# Altium schematic sheet OVPSwitch.SchDoc
size A; SheetNumber: 1; SheetTotal: 1
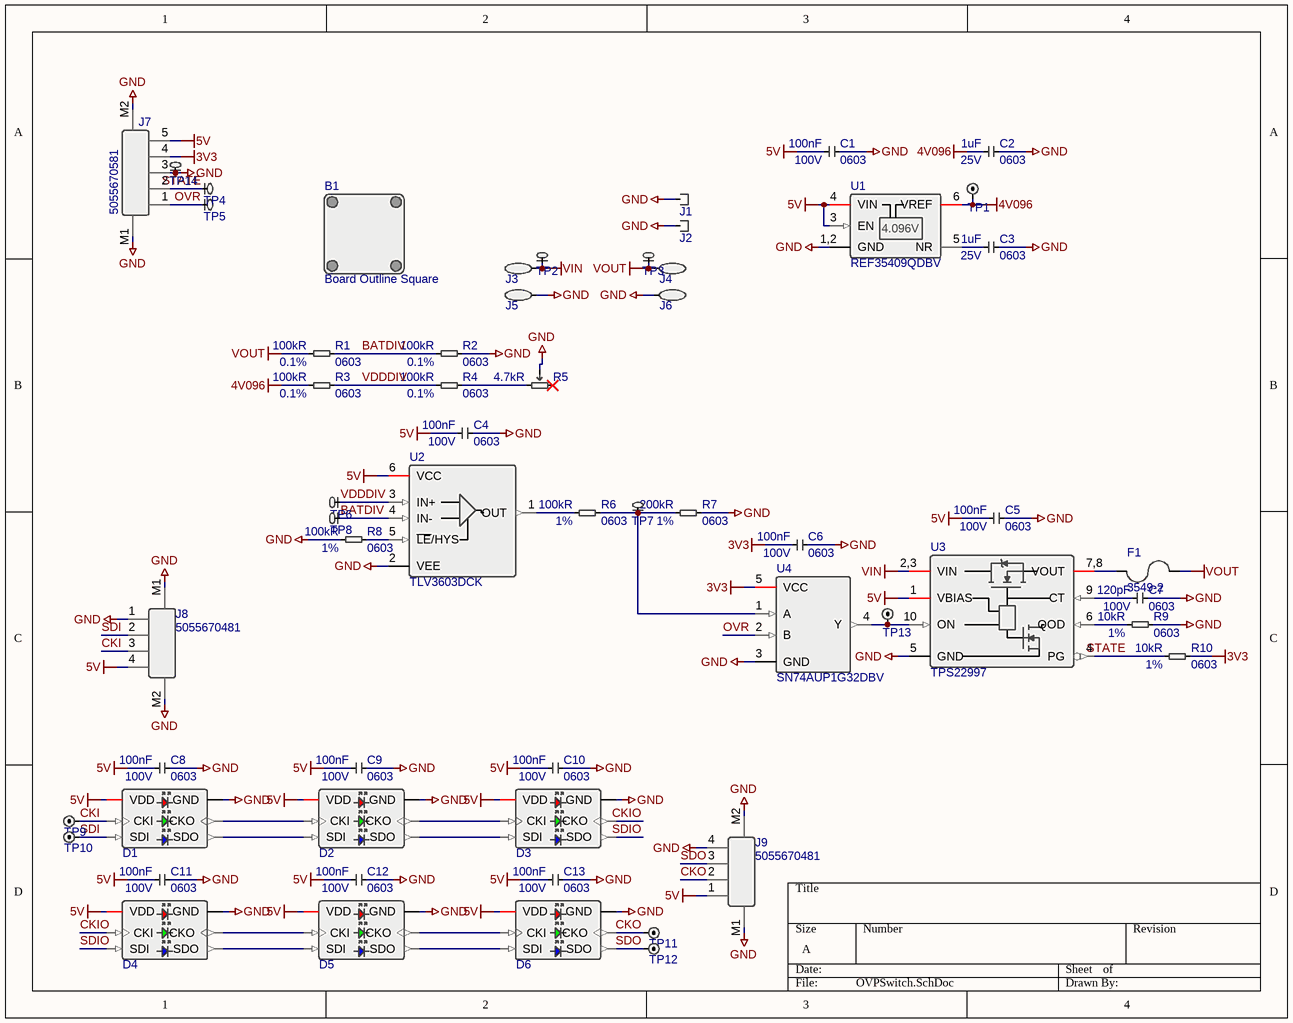
[diagram p0: OVPSwitch.SchDoc]

## Parts
B1  Board Outline Square  [PCB_OUTLINE_SQUARE]
C1  value 100nF  Voltage - Rated: 100V  Package/Case Imperial: 0603  [CAPACITOR_0603(1608)_GENERIC]  (hidden comment: Capacitor - Ceramic - Generic)
C2  value 1uF  Voltage - Rated: 25V  Package/Case Imperial: 0603  [CAPACITOR_0603(1608)_GENERIC]  (hidden comment: Capacitor - Ceramic - Generic)
C3  value 1uF  Voltage - Rated: 25V  Package/Case Imperial: 0603  [CAPACITOR_0603(1608)_GENERIC]  (hidden comment: Capacitor - Ceramic - Generic)
C4  value 100nF  Voltage - Rated: 100V  Package/Case Imperial: 0603  [CAPACITOR_0603(1608)_GENERIC]  (hidden comment: Capacitor - Ceramic - Generic)
C5  value 100nF  Voltage - Rated: 100V  Package/Case Imperial: 0603  [CAPACITOR_0603(1608)_GENERIC]  (hidden comment: Capacitor - Ceramic - Generic)
C6  value 100nF  Voltage - Rated: 100V  Package/Case Imperial: 0603  [CAPACITOR_0603(1608)_GENERIC]  (hidden comment: Capacitor - Ceramic - Generic)
C7  value 120pF  Voltage - Rated: 100V  Package/Case Imperial: 0603  [CAPACITOR_0603(1608)_GENERIC]  (hidden comment: Capacitor - Ceramic - Generic)
C8  value 100nF  Voltage - Rated: 100V  Package/Case Imperial: 0603  [CAPACITOR_0603(1608)_GENERIC]  (hidden comment: Capacitor - Ceramic - Generic)
C9  value 100nF  Voltage - Rated: 100V  Package/Case Imperial: 0603  [CAPACITOR_0603(1608)_GENERIC]  (hidden comment: Capacitor - Ceramic - Generic)
C10  value 100nF  Voltage - Rated: 100V  Package/Case Imperial: 0603  [CAPACITOR_0603(1608)_GENERIC]  (hidden comment: Capacitor - Ceramic - Generic)
C11  value 100nF  Voltage - Rated: 100V  Package/Case Imperial: 0603  [CAPACITOR_0603(1608)_GENERIC]  (hidden comment: Capacitor - Ceramic - Generic)
C12  value 100nF  Voltage - Rated: 100V  Package/Case Imperial: 0603  [CAPACITOR_0603(1608)_GENERIC]  (hidden comment: Capacitor - Ceramic - Generic)
C13  value 100nF  Voltage - Rated: 100V  Package/Case Imperial: 0603  [CAPACITOR_0603(1608)_GENERIC]  (hidden comment: Capacitor - Ceramic - Generic)
D1  APA102C  [5X5MM(6PIN)_JLEAD_GENERIC]  (value not drawn)
D2  APA102C  [5X5MM(6PIN)_JLEAD_GENERIC]  (value not drawn)
D3  APA102C  [5X5MM(6PIN)_JLEAD_GENERIC]  (value not drawn)
D4  APA102C  [5X5MM(6PIN)_JLEAD_GENERIC]  (value not drawn)
D5  APA102C  [5X5MM(6PIN)_JLEAD_GENERIC]  (value not drawn)
D6  APA102C  [5X5MM(6PIN)_JLEAD_GENERIC]  (value not drawn)
F1  3549-2  [FUSE_HOLDER_KEYSTONE_3549-2]
J1  PP45 Staple  [CONNECTOR_ACCESSORY_PP45-STAPLE_ANDERSON]  (value not drawn)
J2  PP45 Staple  [CONNECTOR_ACCESSORY_PP45-STAPLE_ANDERSON]  (value not drawn)
J3  PP45  [CONNECTOR_BTOC_PP45_ANDERSON]  (value not drawn)
J4  PP45  [CONNECTOR_BTOC_PP45_ANDERSON]  (value not drawn)
J5  PP45  [CONNECTOR_BTOC_PP45_ANDERSON]  (value not drawn)
J6  PP45  [CONNECTOR_BTOC_PP45_ANDERSON]  (value not drawn)
J7  Manufacturer Part Number 1: 5055670581  [CONNECTOR_HEADER_MOLEX_5055670581]  (hidden comment: Connector - Header - 5P 2M - Generic)
J8  Manufacturer Part Number 1: 5055670481  [CONNECTOR_HEADER_MOLEX_5055670481]  (hidden comment: Connector - Header - 4P 2M - Generic)
J9  Manufacturer Part Number 1: 5055670481  [CONNECTOR_HEADER_MOLEX_5055670481]  (hidden comment: Connector - Header - 4P 2M - Generic)
R1  value 100kR  Tolerance: 0.1%  Package/Case Imperial: 0603  [RESISTOR_0603(1608)_GENERIC]  (hidden comment: Resistor - Fixed - Generic)
R2  value 100kR  Tolerance: 0.1%  Package/Case Imperial: 0603  [RESISTOR_0603(1608)_GENERIC]  (hidden comment: Resistor - Fixed - Generic)
R3  value 100kR  Tolerance: 0.1%  Package/Case Imperial: 0603  [RESISTOR_0603(1608)_GENERIC]  (hidden comment: Resistor - Fixed - Generic)
R4  value 100kR  Tolerance: 0.1%  Package/Case Imperial: 0603  [RESISTOR_0603(1608)_GENERIC]  (hidden comment: Resistor - Fixed - Generic)
R5  value 4.7kR  [RESISTOR_VARIABLE_TC33_BOURNS]  (hidden comment: TC33X)
R6  value 100kR  Tolerance: 1%  Package/Case Imperial: 0603  [RESISTOR_0603(1608)_GENERIC]  (hidden comment: Resistor - Fixed - Generic)
R7  value 200kR  Tolerance: 1%  Package/Case Imperial: 0603  [RESISTOR_0603(1608)_GENERIC]  (hidden comment: Resistor - Fixed - Generic)
R8  value 100kR  Tolerance: 1%  Package/Case Imperial: 0603  [RESISTOR_0603(1608)_GENERIC]  (hidden comment: Resistor - Fixed - Generic)
R9  value 10kR  Tolerance: 1%  Package/Case Imperial: 0603  [RESISTOR_0603(1608)_GENERIC]  (hidden comment: Resistor - Fixed - Generic)
R10  value 10kR  Tolerance: 1%  Package/Case Imperial: 0603  [RESISTOR_0603(1608)_GENERIC]  (hidden comment: Resistor - Fixed - Generic)
TP1  Test Point - THT  [TESTPOINT_THT_OCTAGON]  (value not drawn)
TP2  519XTR  [TESTPOINT_LOOP_SMD_KEYSTONE_519X]  (value not drawn)
TP3  519XTR  [TESTPOINT_LOOP_SMD_KEYSTONE_519X]  (value not drawn)
TP4  519XTR  [TESTPOINT_LOOP_SMD_KEYSTONE_519X]  (value not drawn)
TP5  519XTR  [TESTPOINT_LOOP_SMD_KEYSTONE_519X]  (value not drawn)
TP6  519XTR  [TESTPOINT_LOOP_SMD_KEYSTONE_519X]  (value not drawn)
TP7  519XTR  [TESTPOINT_LOOP_SMD_KEYSTONE_519X]  (value not drawn)
TP8  519XTR  [TESTPOINT_LOOP_SMD_KEYSTONE_519X]  (value not drawn)
TP9  Test Point - THT  [TESTPOINT_THT_OCTAGON]  (value not drawn)
TP10  Test Point - THT  [TESTPOINT_THT_OCTAGON]  (value not drawn)
TP11  Test Point - THT  [TESTPOINT_THT_OCTAGON]  (value not drawn)
TP12  Test Point - THT  [TESTPOINT_THT_OCTAGON]  (value not drawn)
TP13  Test Point - THT  [TESTPOINT_THT_OCTAGON]  (value not drawn)
TP14  519XTR  [TESTPOINT_LOOP_SMD_KEYSTONE_519X]  (value not drawn)
U1  REF35409QDBV  [SOT23-6(DBV0006A)_TI]
U2  TLV3603DCK  [SC70-6(DCK0006A)_TI]
U3  TPS22997  [WQFN-10(RYZ0010A)_TI]
U4  SN74AUP1G32DBV  [SOT23-5(DBV0005A)_TI]

## Nets
3V3: C6.1 J7.4 R10.2 U4.5(VCC)
4V096: C2.2 R3.1 TP1.1 U1.6(VREF)
5V: C1.1 C4.1 C5.1 C8.1 C9.1 C10.1 C11.1 C12.1 C13.1 D1.4(VDD) D2.4(VDD) D3.4(VDD) D4.4(VDD) D5.4(VDD) D6.4(VDD) J7.5 J8.4 J9.1 U1.3(EN) U1.4(VIN) U2.6(VCC) U3.1(VBIAS)
GND: C1.2 C2.1 C3.1 C4.2 C5.2 C6.2 C7.2 C8.2 C9.2 C10.2 C11.2 C12.2 C13.2 D1.3(GND) D2.3(GND) D3.3(GND) D4.3(GND) D5.3(GND) D6.3(GND) J1.1 J2.1 J5.1 J6.1 J7.3 J7.M1 J7.M2 J8.1 J8.M1 J8.M2 J9.4 J9.M1 J9.M2 R2.2 R5.2 R7.2 R8.1 R9.2 TP14.1 U1.1,2(GND) U2.2(VEE) U3.5(GND) U4.3(GND)
VIN: J3.1 TP2.1 U3.2,3(VIN)
VOUT: F1.1 J4.1 R1.1 TP3.1
BATDIV: R1.2 R2.1 TP8.1 U2.4(IN-)
CKI: D1.2(CKI) J8.3 TP9.1
CKIO: D3.5(CKO) D4.2(CKI)
CKO: D6.5(CKO) J9.2 TP11.1
OVR: J7.1 TP5.1 U4.2(B)
SDI: D1.1(SDI) J8.2 TP10.1
SDIO: D3.6(SDO) D4.1(SDI)
SDO: D6.6(SDO) J9.3 TP12.1
STATE: J7.2 R10.1 TP4.1 U3.4(PG)
VDDDIV: R3.2 R4.1 TP6.1 U2.3(IN+)
NetC3_2: C3.2 U1.5(NR)
NetC7_1: C7.1 U3.9(CT)
NetD1_5: D1.5(CKO) D2.2(CKI)
NetD1_6: D1.6(SDO) D2.1(SDI)
NetD2_5: D2.5(CKO) D3.2(CKI)
NetD2_6: D2.6(SDO) D3.1(SDI)
NetD4_5: D4.5(CKO) D5.2(CKI)
NetD4_6: D4.6(SDO) D5.1(SDI)
NetD5_5: D5.5(CKO) D6.2(CKI)
NetD5_6: D5.6(SDO) D6.1(SDI)
NetF1_2: F1.2 U3.7,8(VOUT)
NetR4_2: R4.2 R5.1
NetR6_1: R6.1 U2.1(OUT)
NetR6_2: R6.2 R7.1 TP7.1 U4.1(A)
NetR8_2: R8.2 U2.5(~{LE}/HYS)
NetR9_1: R9.1 U3.6(QOD)
NetTP13_1: TP13.1 U3.10(ON) U4.4(Y)

Not connected (* = marked no-connect by the designer): R5 3*

## Notes on the sheet
- (in symbol IC - Power Management - Voltage Reference - TI REF35409) 4.096V

## Library data of the parts
B1 = Board_Outline_Square
C1 C4-C6 C8-C13 = CAP-CER_100NF_100V_20%_X7R_0603(1608): 100nF ±20% 100V Ceramic Capacitor X7R 0603(1608 Metric); Manufacturer 1: Murata Electronics; Manufacturer Part Number 1: GRM188R72A104KA35D; Manufacturer Lifecycle 1: Active; Package/Case Metric: 1608; Name: CAP-CER_100NF_100V_20%_X7R_0603(1608); Item: CAP-CER; Temperature Coefficient: X7R; Tolerance: 20%; Mounting Type: SMT; Full Item: Ceramic Capacitor; Manufacturer 2: Murata Electronics; Manufacturer Part Number 2: GRM188R72A104KA35J; Manufacturer Lifecycle 2: Active; Manufacturer 3: Murata Electronics; Manufacturer Part Number 3: GRM188R72A104MA35D; Manufacturer Lifecycle 3: Active
C2 C3 = CAP-CER_1UF_25V_20%_X7R_0603(1608): 1uF ±20% 25V Ceramic Capacitor X7R 0603(1608 Metric); Manufacturer 1: Murata Electronics; Manufacturer Part Number 1: GCM188R71E105KA64D; Manufacturer Lifecycle 1: Active; Package/Case Metric: 1608; Name: CAP-CER_1UF_25V_20%_X7R_0603(1608); Item: CAP-CER; Temperature Coefficient: X7R; Tolerance: 20%; Mounting Type: SMT; Full Item: Ceramic Capacitor; Manufacturer 2: Murata Electronics; Manufacturer Part Number 2: GCM188R71E105KA64J; Manufacturer Lifecycle 2: Active; Manufacturer 3: Murata Electronics; Manufacturer Part Number 3: GCM188R71E105MA64D; Manufacturer Lifecycle 3: Active
C7 = CAP-CER_120PF_100V_5%_C0G/NP0_0603(1608): 120pF ±5% 100V Ceramic Capacitor C0G/NP0 0603(1608 Metric); Manufacturer 1: Murata Electronics; Manufacturer Part Number 1: GCM1885C2A121FA16D; Manufacturer Lifecycle 1: Active; Package/Case Metric: 1608; Name: CAP-CER_120PF_100V_5%_C0G/NP0_0603(1608); Item: CAP-CER; Temperature Coefficient: C0G/NP0; Tolerance: 5%; Mounting Type: SMT; Full Item: Ceramic Capacitor; Manufacturer 2: Murata Electronics; Manufacturer Part Number 2: GCM1885C2A121JA16D; Manufacturer Lifecycle 2: Active; Manufacturer 3: Murata Electronics; Manufacturer Part Number 3: GCM1885C2A121FA16J; Manufacturer Lifecycle 3: Active
D1-D6 = Diode - LED - Addressable - 5x5mm APA102C: Supplier 1: Digi-Key; Supplier Part Number 1: 1568-COM-16345-ND; Supplier 2: Mouser; Supplier Part Number 2: 474-COM-16345
F1 = Fuse - Holder - Keystone 3549-2: Supplier 1: Digi-Key; Supplier Part Number 1: 36-3549-2-ND; Supplier 2: Mouser; Supplier Part Number 2: 534-3549-2
J1 J2 = Connector - Accessory - Mechanical Support - Anderson PP45 Staple
J3-J6 = Connector - Modular - 1P - Anderson PP45
J7 = CON_HDR_5P_1.25MM-PITCH_50V_2.4A_SMT_MOLEX_5055670581: Connector Header 5 Pin 1.25mm Pitch Mating 50V 2.4A Rated 7 Walls Shrouded SMT Molex 5055670581; Manufacturer Lifecycle 1: Active; Number of Positions: 5; Shrouding: 7 Walls; Name: CON_HDR_5P_1.25MM-PITCH_50V_2.4A_SMT_MOLEX_5055670581; Item: CON_HDR; Pitch - Mating: 1.25mm; Fastening Type: Locking Ramp; Voltage - Max: 50V; Current - Max: 2.4A; Mounting Type: SMT; Full Item: Connector Header; Manufacturer 1: Molex
J8 J9 = CON_HDR_4P_1.25MM-PITCH_50V_2.4A_SMT_MOLEX_5055670481: Connector Header 4 Pin 1.25mm Pitch Mating 50V 2.4A Rated 6 Walls Shrouded SMT Molex 5055670481; Manufacturer Lifecycle 1: Active; Number of Positions: 4; Shrouding: 6 Walls; Name: CON_HDR_4P_1.25MM-PITCH_50V_2.4A_SMT_MOLEX_5055670481; Item: CON_HDR; Pitch - Mating: 1.25mm; Fastening Type: Locking Ramp; Voltage - Max: 50V; Current - Max: 2.4A; Mounting Type: SMT; Full Item: Connector Header; Manufacturer 1: Molex
R1-R4 = RES-FXD_100KR_0.1%_100MW_10PPM/°C_0603(1608): 100kR ±0.1% 100mW Chip Resistor 10ppm/°C 0603(1608 Metric); Manufacturer 1: Panasonic; Manufacturer Part Number 1: ERA-3ARB104V; Manufacturer Lifecycle 1: Active; Package/Case Metric: 1608; Name: RES-FXD_100KR_0.1%_100MW_10PPM/°C_0603(1608); Item: RES-FXD; Temperature Coefficient: 10ppm/°C; Power: 100mW; Mounting Type: SMT; Full Item: Chip Resistor
R5 = Resistor - Variable - Bourns TC33
R6 R8 = RES-FXD_100KR_1%_100MW_100PPM/°C_0603(1608): 100kR ±1% 100mW Chip Resistor 100ppm/°C 0603(1608 Metric); Manufacturer 1: Bourns Inc.; Manufacturer Part Number 1: CR0603-FX-1003ELF; Manufacturer Lifecycle 1: Active; Package/Case Metric: 1608; Name: RES-FXD_100KR_1%_100MW_100PPM/°C_0603(1608); Item: RES-FXD; Temperature Coefficient: 100ppm/°C; Power: 100mW; Mounting Type: SMT; Full Item: Chip Resistor; Manufacturer 2: Bourns Inc.; Manufacturer Part Number 2: CR0603AFX-1003EAS; Manufacturer Lifecycle 2: Active; Manufacturer 3: Bourns Inc.; Manufacturer Part Number 3: CMP0603AFX-1003ELF; Manufacturer Lifecycle 3: Active
R7 = RES-FXD_200KR_1%_100MW_100PPM/°C_0603(1608): 200kR ±1% 100mW Chip Resistor 100ppm/°C 0603(1608 Metric); Manufacturer 1: Bourns Inc.; Manufacturer Part Number 1: CR0603-FX-2003ELF; Manufacturer Lifecycle 1: Active; Package/Case Metric: 1608; Name: RES-FXD_200KR_1%_100MW_100PPM/°C_0603(1608); Item: RES-FXD; Temperature Coefficient: 100ppm/°C; Power: 100mW; Mounting Type: SMT; Full Item: Chip Resistor; Manufacturer 2: Bourns Inc.; Manufacturer Part Number 2: CR0603AFX-2003EAS; Manufacturer Lifecycle 2: Active
R9 R10 = RES-FXD_10KR_1%_100MW_100PPM/°C_0603(1608): 10kR ±1% 100mW Chip Resistor 100ppm/°C 0603(1608 Metric); Manufacturer 1: Bourns Inc.; Manufacturer Part Number 1: CR0603-FX-1002ELF; Manufacturer Lifecycle 1: Active; Package/Case Metric: 1608; Name: RES-FXD_10KR_1%_100MW_100PPM/°C_0603(1608); Item: RES-FXD; Temperature Coefficient: 100ppm/°C; Power: 100mW; Mounting Type: SMT; Full Item: Chip Resistor; Manufacturer 2: Bourns Inc.; Manufacturer Part Number 2: CR0603AFX-1002EAS; Manufacturer Lifecycle 2: Active; Manufacturer 3: Bourns Inc.; Manufacturer Part Number 3: CMP0603-FX-1002ELF; Manufacturer Lifecycle 3: Active
TP2-TP8 TP14 = Test Point - SMT - Loop - Keystone 519X
U1 = IC - Power Management - Voltage Reference - TI REF35409: Supplier 1: Texas Instruments; Supplier Part Number 1: REF35409QDBVR; Supplier 2: Digi-Key; Supplier Part Number 2: 296-REF35409QDBVRCT-ND; Supplier 3: Digi-Key; Supplier Part Number 3: 296-REF35409QDBVRDKR-ND; Supplier 4: Mouser; Supplier Part Number 4: 595-REF35409QDBVR
U2 = IC - Amplifier - Comparators - TI TLV3603DCK: Supplier 1: Mouser; Supplier Part Number 1: 595-TLV3603DCKR; Supplier 2: Texas Instruments; Supplier Part Number 2: TLV3603DCKR; Supplier 3: Digi-Key; Supplier Part Number 3: 296-TLV3603DCKRCT-ND; Supplier 4: Digi-Key; Supplier Part Number 4: 296-TLV3603DCKRDKR-ND; Supplier 5: Mouser; Supplier Part Number 5: 595-TLV3603DCKT; Supplier 6: Texas Instruments; Supplier Part Number 6: TLV3603DCKT; Supplier 7: Digi-Key; Supplier Part Number 7: 296-TLV3603DCKTCT-ND; Supplier 8: Digi-Key; Supplier Part Number 8: 296-TLV3603DCKTDKR-ND
U3 = IC - Power Management - Load Switch - TI TPS22997: Supplier 1: Mouser; Supplier Part Number 1: 595-TPS22997RYZR; Supplier 2: Texas Instruments; Supplier Part Number 2: TPS22997RYZR; Supplier 3: Digi-Key; Supplier Part Number 3: 296-TPS22997RYZRCT-ND; Supplier 4: Digi-Key; Supplier Part Number 4: 296-TPS22997RYZRDKR-ND
U4 = IC - Logic - OR Gate - TI SN74AUP1G32: Supplier 1: Mouser; Supplier Part Number 1: 595-SN74AUP1G32DBVR; Supplier 2: Texas Instruments; Supplier Part Number 2: SN74AUP1G32DBVR; Supplier 3: Digi-Key; Supplier Part Number 3: 296-19079-1-ND; Supplier 4: Digi-Key; Supplier Part Number 4: 296-19079-6-ND; Supplier 5: Digi-Key; Supplier Part Number 5: 296-19079-2-ND